# Altium schematic sheet nfc.SchDoc
size A3; PageSetup: Record=PageOptions|CenterHorizontal=True|CenterVertical=True|PrintScale=1.00|XCorrection=1.00|YCorrection=1.00|PrintKind=1|BorderSize=5000000|LeftOffset=0|BottomOffset=0|Orientation=2|PaperLength=1000|PaperWidth=1000|Scale=100|PaperSource=7|PrintQuality=-4|MediaType=1|DitherType=10|PaperKind=A4|PrintScaleMode=1
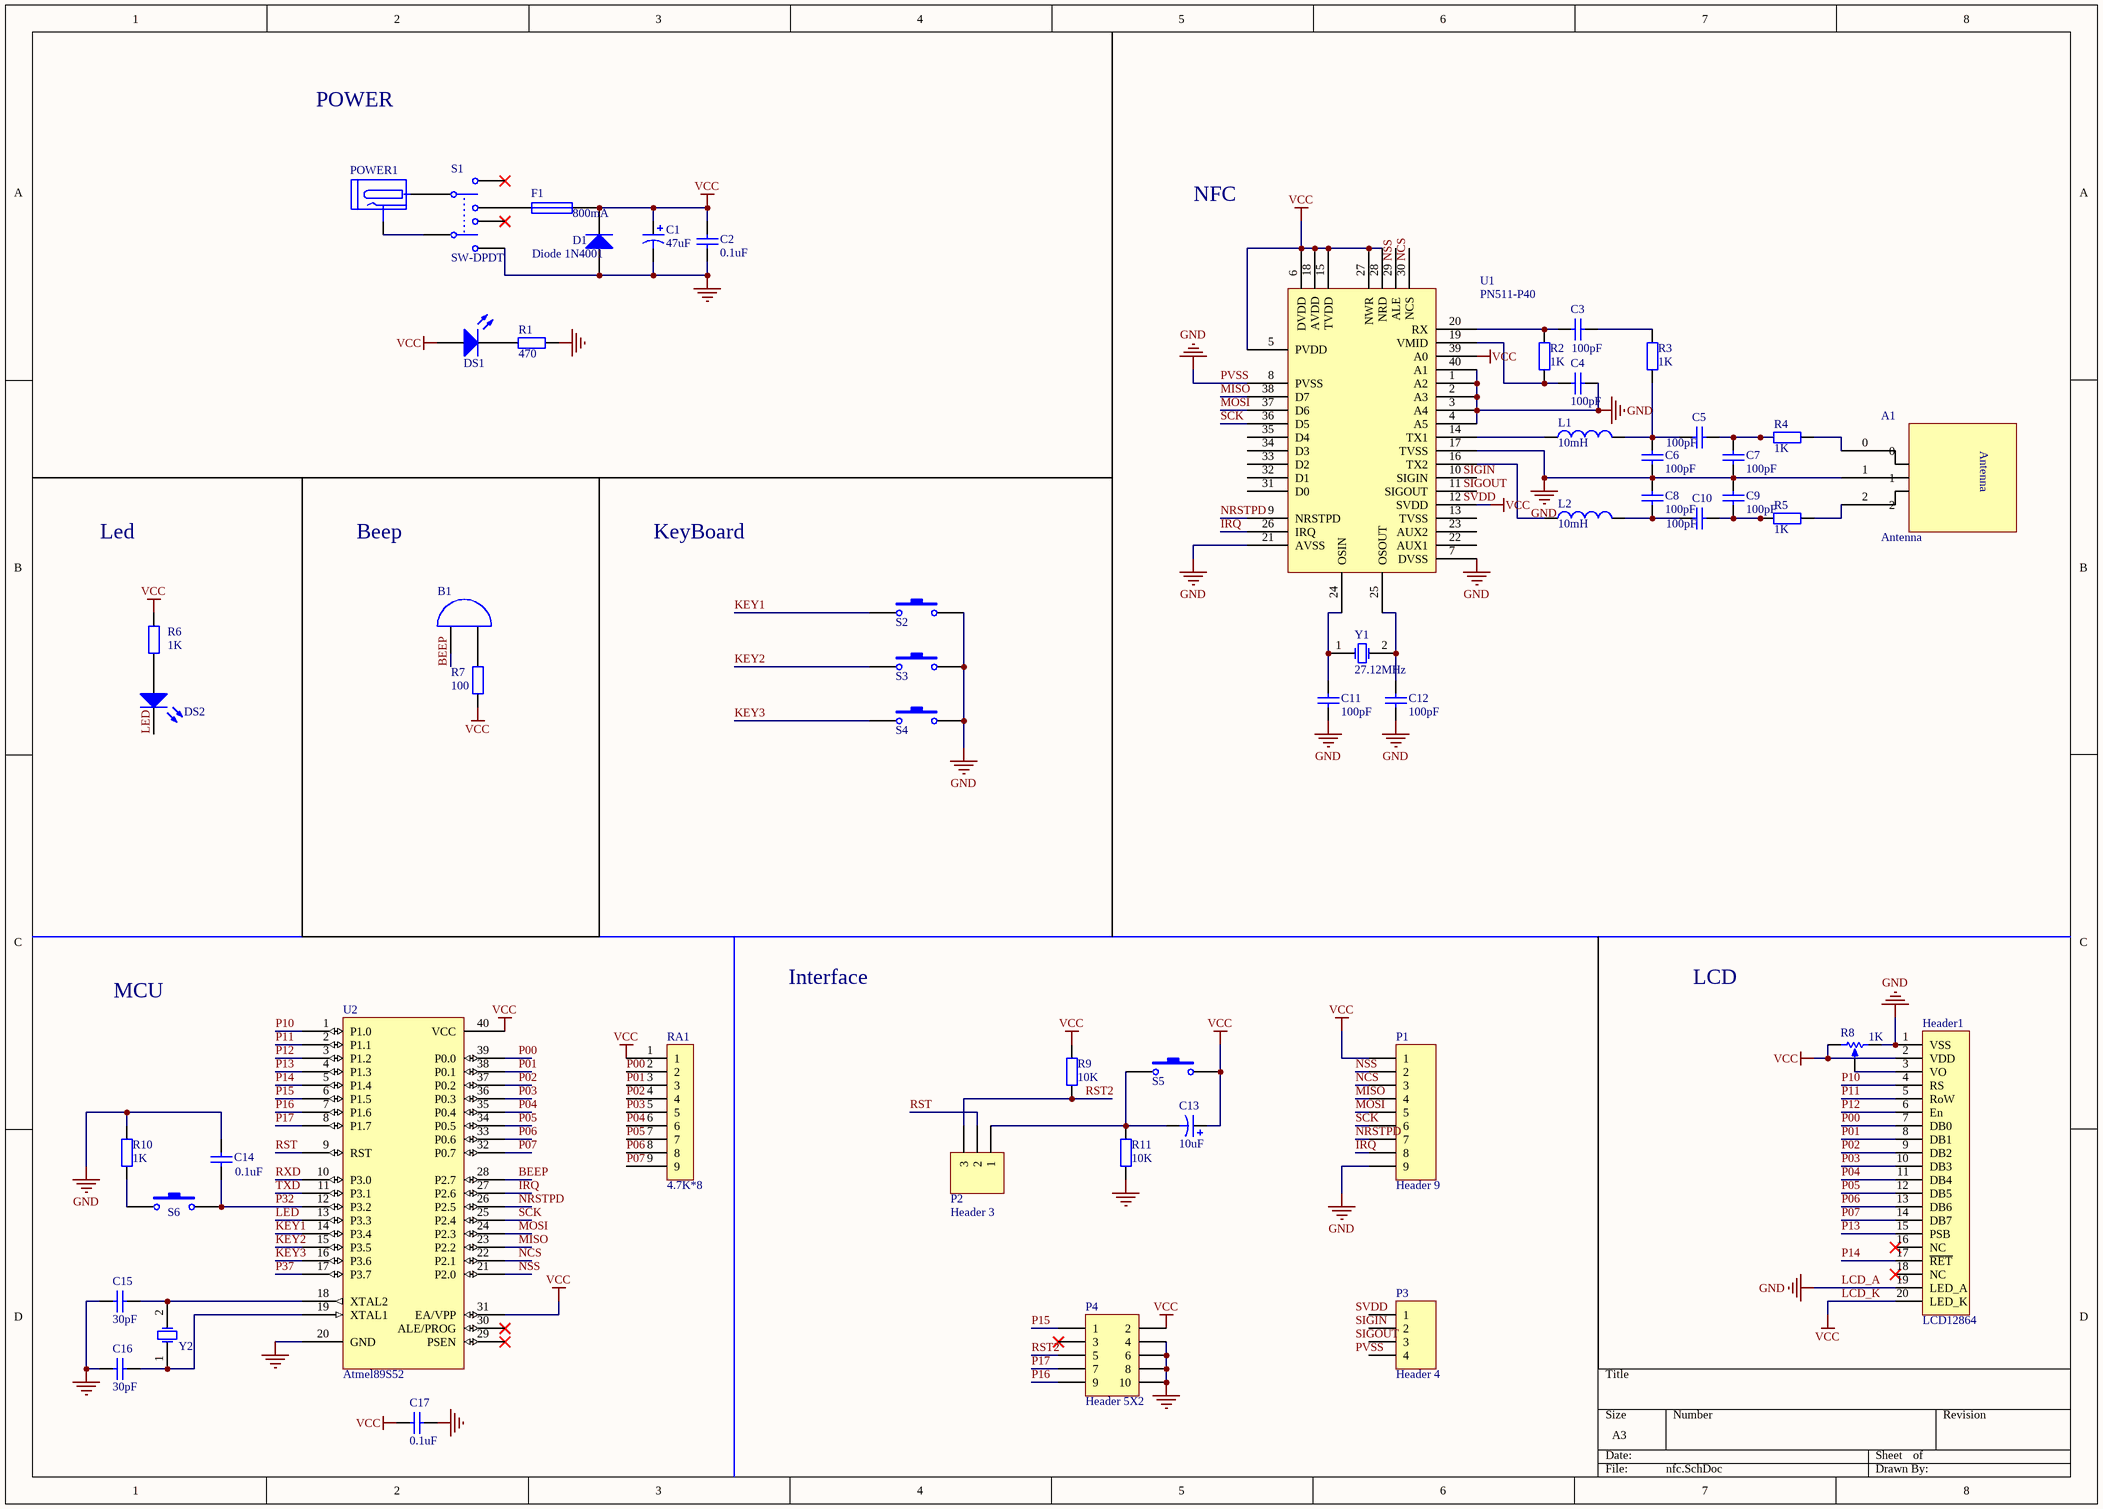
[diagram p0: nfc.SchDoc]

## Parts
A1  Antenna
B1  BEEP  [Buzzer]  (value not drawn)
C1  value 47uF  [CAP-LED]  (hidden comment: CAP POL)
C2  value 0.1uF  [CAP]  (hidden comment: Cap)
C3  value 100pF  [RAD-0.3]  (hidden comment: Cap)
C4  value 100pF  [RAD-0.3]  (hidden comment: Cap)
C5  value 100pF  [RAD-0.3]  (hidden comment: Cap)
C6  value 100pF  [RAD-0.3]  (hidden comment: Cap)
C7  value 100pF  [RAD-0.3]  (hidden comment: Cap)
C8  value 100pF  [RAD-0.3]  (hidden comment: Cap)
C9  value 100pF  [RAD-0.3]  (hidden comment: Cap)
C10  value 100pF  [RAD-0.3]  (hidden comment: Cap)
C11  value 100pF  [RAD-0.3]  (hidden comment: Cap)
C12  value 100pF  [RAD-0.3]  (hidden comment: Cap)
C13  value 10uF  [CAP-LED]  (hidden comment: CAP POL)
C14  value 0.1uF  [VP32-3.2]  (hidden comment: Cap)
C15  value 30pF  [CAP]  (hidden comment: Cap)
C16  value 30pF  [CAP]  (hidden comment: Cap)
C17  value 0.1uF  [VP32-3.2]  (hidden comment: Cap)
D1  Diode 1N4001  [DIODE-0.4]
DS1  LED  [CAP-LED]  (value not drawn)
DS2  LED  [CAP-LED]  (value not drawn)
F1  value 800mA  [AXIAL-0.3]  (hidden comment: FUSE1)
Header1  LCD12864
L1  value 10mH  [0402-A]  (hidden comment: Inductor)
L2  value 10mH  [0402-A]  (hidden comment: Inductor)
P1  Header 9  [HDR1X9]
P2  Header 3  [HDR1X3]
P3  Header 4  [HDR1X4]
P4  Header 5X2  [HDR2X5]
POWER1  POWER  [Power]  (value not drawn)
R1  value 470  [AXIAL-0.4]  (hidden comment: RES)
R2  value 1K  [AXIAL-0.4]  (hidden comment: Res2)
R3  value 1K  [AXIAL-0.4]  (hidden comment: Res2)
R4  value 1K  [AXIAL-0.4]  (hidden comment: Res2)
R5  value 1K  [AXIAL-0.4]  (hidden comment: Res2)
R6  value 1K  [AXIAL-0.4]  (hidden comment: RES)
R7  value 100  [AXIAL-0.4]  (hidden comment: RES)
R8  value 1K  [VR5]  (hidden comment: RPot)
R9  value 10K  [AXIAL-0.4]  (hidden comment: RES)
R10  value 1K  [AXIAL-0.4]  (hidden comment: RES)
R11  value 10K  [AXIAL-0.4]  (hidden comment: RES)
RA1  value 4.7K*8  [HDR1X9]  (hidden comment: Res Arry)
S1  SW-DPDT  [SWITCH-6]
S2  SW-PB  [key]  (value not drawn)
S3  SW-PB  [key]  (value not drawn)
S4  SW-PB  [key]  (value not drawn)
S5  SW-PB  [key]  (value not drawn)
S6  SW-PB  [key]  (value not drawn)
U1  PN511-P40
U2  Atmel89S52  [ATMEL89S52-DIP40]
Y1  27.12MHz  [R38]
Y2  XTAL  [XTAL]  (value not drawn)

## Nets
LCD_A: A1.1 C1.2 C2.2 C4.2 C6.1 C7.1 C8.2 C9.2 C11.1 C12.1 C14.2 C15.1 C16.1 C17.2 D1.1(A) Header1.1(VSS) Header1.19(LED_A) P1.9 P4.4 P4.6 P4.8 P4.10 R1.2 R8.2(BOT) R10.2 R11.1 S1.6 S2.2 S3.2 S4.2 U1.1(A2) U1.2(A3) U1.3(A4) U1.4(A5) U1.7(DVSS) U1.8(PVSS) U1.17(TVSS) U1.21(AVSS) U1.40(A1) U2.20(GND)  [also labelled GND, PVSS]
LCD_K: C1.1 C2.1 C13.1 C17.1 D1.2(K) DS1.1(A) F1.2 Header1.2(VDD) Header1.20(LED_K) P1.1 P4.2 R6.2 R7.2 R8.1(TOP) R9.1 RA1.1 S5.2 U1.5(PVDD) U1.6(DVDD) U1.12(SVDD) U1.15(TVDD) U1.18(AVDD) U1.27(NWR) U1.28(NRD) U1.39(A0) U2.31(EA/VPP) U2.40(VCC)  [also labelled VCC]
BEEP: B1.2(A) U2.28(P2.7)
IRQ: P1.8 U1.26(IRQ) U2.27(P2.6)
KEY1: S2.1 U2.14(P3.4)
KEY2: S3.1 U2.15(P3.5)
KEY3: S4.1 U2.16(P3.6)
LED: DS2.2(K) U2.13(P3.3)
MISO: P1.4 U1.38(D7) U2.23(P2.2)
MOSI: P1.5 U1.37(D6) U2.24(P2.3)
NCS: P1.3 U2.22(P2.1)
NRSTPD: P1.7 U1.9(NRSTPD) U2.26(P2.5)
NSS: P1.2 U2.21(P2.0)
P00: Header1.7(DB0) RA1.2 U2.39(P0.0)
P01: Header1.8(DB1) RA1.3 U2.38(P0.1)
P02: Header1.9(DB2) RA1.4 U2.37(P0.2)
P03: Header1.10(DB3) RA1.5 U2.36(P0.3)
P04: Header1.11(DB4) RA1.6 U2.35(P0.4)
P05: Header1.12(DB5) RA1.7 U2.34(P0.5)
P06: Header1.13(DB6) RA1.8 U2.33(P0.6)
P07: Header1.14(DB7) RA1.9 U2.32(P0.7)
P10: Header1.4(RS) U2.1(P1.0)
P11: Header1.5(RoW) U2.2(P1.1)
P12: Header1.6(En) U2.3(P1.2)
P13: Header1.15(PSB) U2.4(P1.3)
P14: Header1.17(~{RET}) U2.5(P1.4)
P15: P4.1 U2.6(P1.5)
P16: P4.9 U2.7(P1.6)
P17: P4.7 U2.8(P1.7)
P32: C14.1 S6.2 U2.12(P3.2)
P37: U2.17(P3.7)
RST: P2.2 U2.9(RST)
RST2: P2.3 P4.5 R9.2
RXD: U2.10(P3.0)
SCK: P1.6 U1.36(D5) U2.25(P2.4)
TXD: U2.11(P3.1)
NetA1_0: A1.0 R4.1
NetA1_2: A1.2 R5.1
NetB1_1: B1.1(B) R7.1
NetC3_1: C3.1 R2.2 U1.20(RX)
NetC3_2: C3.2 R3.2
NetC4_1: C4.1 R2.1 U1.19(VMID)
NetC5_1: C5.1 C6.2 L1.2 R3.1
NetC5_2: C5.2 C7.2 R4.2
NetC8_1: C8.1 C10.1 L2.2
NetC9_1: C9.1 C10.2 R5.2
NetC11_2: C11.2 U1.24(OSIN) Y1.1(OSC1)
NetC12_2: C12.2 U1.25(OSOUT) Y1.2(OSC2)
NetC13_2: C13.2 P2.1 R11.2 S5.1
NetC15_2: C15.2 U2.18(XTAL2) Y2.2(OSC2)
NetC16_2: C16.2 U2.19(XTAL1) Y2.1(OSC1)
NetDS1_2: DS1.2(K) R1.1
NetDS2_1: DS2.1(A) R6.1
NetF1_1: F1.1 S1.3
NetHeader1_3: Header1.3(VO) R8.3(TAP)
NetL1_1: L1.1 U1.14(TX1)
NetL2_1: L2.1 U1.16(TX2)
NetPOWER1_1: POWER1.1 S1.1
NetPOWER1_2: POWER1.2 S1.4
NetR10_1: R10.1 S6.1

Not connected (* = marked no-connect by the designer): Header1 16(NC)* 18(NC)*; P3 1 2 3 4; P4 3*; S1 2* 5*; U1 10(SIGIN) 11(SIGOUT) 13(TVSS) 22(AUX1) 23(AUX2) 29(ALE) 30(NCS) 31(D0) 32(D1) 33(D2) 34(D3) 35(D4); U2 29(PSEN)* 30(ALE/PROG)*

## Notes on the sheet
- POWER
- NFC
- Led
- Beep
- KeyBoard
- Interface
- LCD
- MCU
- Labels drawn without touching a wire or pin: NCS, NSS, PVSS, SIGIN, SIGOUT, SVDD

## Library data of the parts
C1 C13 = CAP POL: Polarized Capacitor (Axial); Published: 8-Jun-2000; LatestRevisionDate: 17-Jul-2002; LatestRevisionNote: Re-released for DXP Platform.; Publisher: Altium Limited
C2-C12 C14-C17 = Cap: Capacitor; Published: 8-Jun-2000; LatestRevisionDate: 17-Jul-2002; LatestRevisionNote: Re-released for DXP Platform.; Publisher: Altium Limited
  C3-C12 C14 C17: PackageReference: RAD-0.3
D1 = Diode 1N4001: 1 Amp General Purpose Rectifier; Revision 1: 11-Jul-2000: SIM Model Added.; Revision 2: 17-Jul-2002: Re-released for DXP Platform.; Package Information: Latest Revision: Aug-1999; Code - JEDEC: DO-204-AL; Published: 8-Jun-2000; Datasheet: Latest Revision: 1998; Package Reference: DO-41; Publisher: Altium Limited
L1 L2 = Inductor: Code_IEC: 1005; Published: 8-Jun-2000; LatestRevisionDate: 17-Jul-2002; LatestRevisionNote: Re-released for DXP Platform.; PackageReference: 0402-A; Publisher: Altium Limited; Code_JEITA: 0402
P1 = Header 9: Header, 9-Pin; LatestRevisionDate: 17-Jul-2002; LatestRevisionNote: Re-released for DXP Platform.; Publisher: Altium Limited
P2 = Header 3: Header, 3-Pin; LatestRevisionDate: 17-Jul-2002; LatestRevisionNote: Re-released for DXP Platform.; Publisher: Altium Limited
P3 = Header 4: Header, 4-Pin; LatestRevisionDate: 17-Jul-2002; LatestRevisionNote: Re-released for DXP Platform.; Publisher: Altium Limited
P4 = Header 5X2: Header, 5-Pin, Dual row; LatestRevisionDate: 17-Jul-2002; LatestRevisionNote: Re-released for DXP Platform.; Publisher: Altium Limited
R1 R6 R7 R9-R11 = RES: Resistor; Published: 8-Jun-2000; LatestRevisionDate: 17-Jul-2002; LatestRevisionNote: Re-released for DXP Platform.; Publisher: Altium Limited
R2-R5 = Res2: Resistor; Published: 8-Jun-2000; LatestRevisionDate: 17-Jul-2002; LatestRevisionNote: Re-released for DXP Platform.; PackageReference: AXIAL-0.4; Publisher: Altium Limited
R8 = RPot: Potentiometer; Sim Note: Enter the Resistance value and the set point into parameter fields.; Set Position: 0.5; Published: 8-Jun-2000; LatestRevisionDate: 17-Jul-2002; LatestRevisionNote: Re-released for DXP Platform.; PackageReference: VR5; Publisher: Altium Limited
S1 = SW-DPDT: Double-Pole, Double-Throw Switch; Published: 24-Mar-1999; Revision: July-2002: Re-released for DXP Platform.; Publisher: Altium Limited
Y1 Y2 = XTAL: Crystal Oscillator; Published: 8-Jun-2000; Publisher: Altium Limited
  Y1: LatestRevisionDate: 17-Jul-2002; LatestRevisionNote: Re-released for DXP Platform.; PackageReference: R38
  Y2: Revision: July-2002: Re-released for DXP Platform.